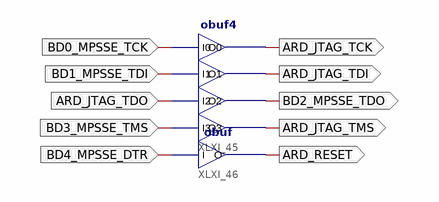
[diagram p0: schematic sheet 1]
// Xilinx ISE schematic Papilio_DUO_LX9.sch (spartan6) as structural Verilog: 2 symbols, 10 ports
module Papilio_DUO_LX9 (
  input  BD0_MPSSE_TCK,
  input  BD1_MPSSE_TDI,
  input  ARD_JTAG_TDO,
  input  BD3_MPSSE_TMS,
  input  BD4_MPSSE_DTR,
  output ARD_JTAG_TCK,
  output ARD_JTAG_TDI,
  output BD2_MPSSE_TDO,
  output ARD_JTAG_TMS,
  output ARD_RESET
);

  obuf4 XLXI_45 (
    .I0(BD0_MPSSE_TCK), .I1(BD1_MPSSE_TDI), .I2(ARD_JTAG_TDO), .I3(BD3_MPSSE_TMS), .O0(ARD_JTAG_TCK),
    .O1(ARD_JTAG_TDI), .O2(BD2_MPSSE_TDO), .O3(ARD_JTAG_TMS));
  obuf XLXI_46 (.I(BD4_MPSSE_DTR), .O(ARD_RESET));
endmodule
